# Altium schematic sheet AMU_type_2_v1.SchDoc
size A3; Engineer: Anthony Kellam; : QUTMS Motor Control version 0.1; PageSetup: Record=PageOptions|CenterHorizontal=True|CenterVertical=True|PrintScale=1.00|XCorrection=1.00|YCorrection=1.00|PrintKind=0|BorderSize=5000000|LeftOffset=0|BottomOffset=0|Orientation=2|PaperLength=1000|PaperWidth=1000|Scale=100|PaperSource=7|PrintQuality=-3|MediaType=1|DitherType=10|PrintScaleMode=0|PaperKind=A3|PaperIndex=8; DocumentName: QUTMS Motor Control rev A
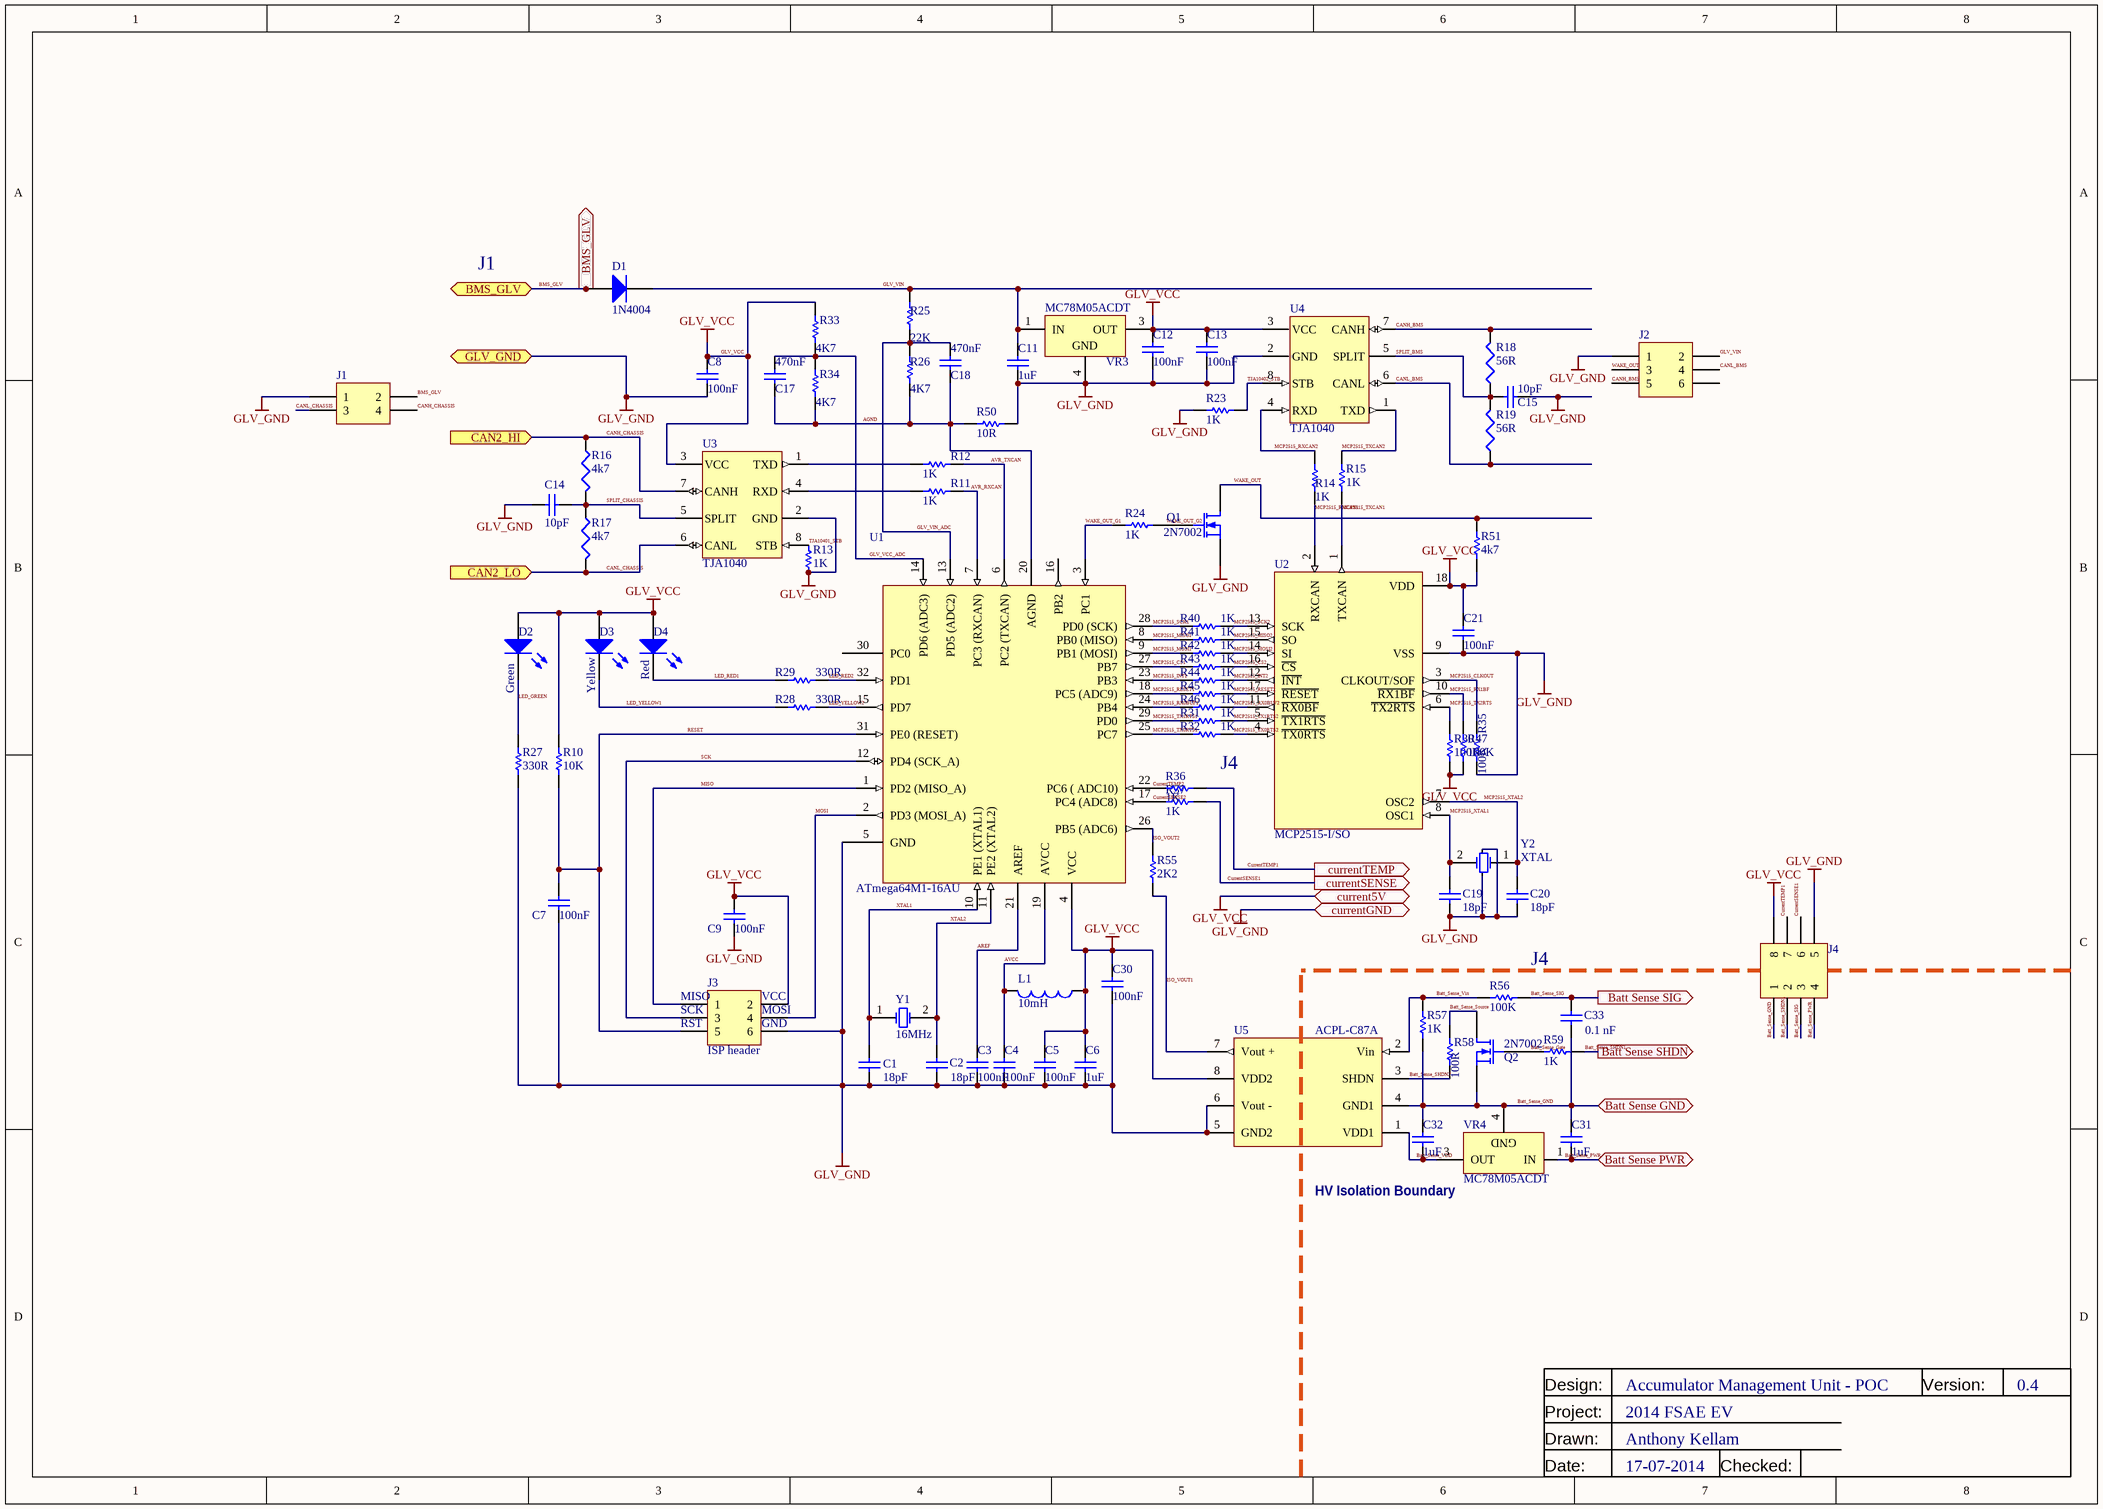
[diagram p0: AMU_type_2_v1.SchDoc]

## Parts
C1  value 18pF  [0603C]  (hidden comment: Cap Semi)
C2  value 18pF  [0603C]  (hidden comment: Cap Semi)
C3  value 100nF  [0603C]  (hidden comment: Cap Semi)
C4  value 100nF  [0603C]  (hidden comment: Cap Semi)
C5  value 100nF  [0603C]  (hidden comment: Cap Semi)
C6  value 1uF  [0603C]  (hidden comment: Cap Semi)
C7  value 100nF  [0603C]  (hidden comment: Cap Semi)
C8  value 100nF  [0603C]  (hidden comment: Cap Semi)
C9  value 100nF  [0603C]  (hidden comment: Cap Semi)
C11  value 1uF  [0603C]  (hidden comment: Cap Semi)
C12  value 100nF  [0603C]  (hidden comment: Cap Semi)
C13  value 100nF  [0603C]  (hidden comment: Cap Semi)
C14  value 10pF  [0603C]  (hidden comment: Cap Semi)
C15  value 10pF  [0603C]  (hidden comment: Cap Semi)
C17  value 470nF  [0603C]  (hidden comment: Cap Semi)
C18  value 470nF  [0603C]  (hidden comment: Cap Semi)
C19  value 18pF  [0603C]  (hidden comment: Cap Semi)
C20  value 18pF  [0603C]  (hidden comment: Cap Semi)
C21  value 100nF  [0603C]  (hidden comment: Cap Semi)
C30  value 100nF  [0603C]  (hidden comment: Cap Semi)
C31  value 1uF  [0603C]  (hidden comment: Cap Semi)
C32  value 1uF  [0603C]  (hidden comment: Cap Semi)
C33  value 0.1 nF  [0603C]  (hidden comment: Cap Semi)
D1  1N4004  [DO-214AC]
D2  Green  [2012[0805]_LED]
D3  Yellow  [2012[0805]_LED]
D4  Red  [2012[0805]_LED]
J1  Header 2X2  [Molex 4 Pin]  (value not drawn)
J2  Header 3X2  [Molex 6 Pin]  (value not drawn)
J3  ISP header  [ISP Header]
J4  Header 4X2  [MOLEX_8]  (value not drawn)
L1  value 10mH  [2012[0805]_IND]  (hidden comment: Inductor)
Q1  2N7002  [SOT23A]
Q2  2N7002  [SOT23A]
R10  value 10K  [2012[0805]_Res]  (hidden comment: Res1)
R11  value 1K  [2012[0805]_Res]  (hidden comment: Res1)
R12  value 1K  [2012[0805]_Res]  (hidden comment: Res1)
R13  value 1K  [2012[0805]_Res]  (hidden comment: Res1)
R14  value 1K  [2012[0805]_Res]  (hidden comment: Res1)
R15  value 1K  [2012[0805]_Res]  (hidden comment: Res1)
R16  value 4k7  [2012[0805]_Res]  (hidden comment: Res3)
R17  value 4k7  [2012[0805]_Res]  (hidden comment: Res3)
R18  value 56R  [2012[0805]_Res]  (hidden comment: Res3)
R19  value 56R  [2012[0805]_Res]  (hidden comment: Res3)
R23  value 1K  [2012[0805]_Res]  (hidden comment: Res1)
R24  value 1K  [2012[0805]_Res]  (hidden comment: Res1)
R25  value 22K  [2012[0805]_Res]  (hidden comment: Res1)
R26  value 4K7  [2012[0805]_Res]  (hidden comment: Res1)
R27  value 330R  [2012[0805]_Res]  (hidden comment: Res1)
R28  value 330R  [2012[0805]_Res]  (hidden comment: Res1)
R29  value 330R  [2012[0805]_Res]  (hidden comment: Res1)
R30  value 100K  [2012[0805]_Res]  (hidden comment: Res1)
R31  value 1K  [2012[0805]_Res]  (hidden comment: Res1)
R32  value 1K  [2012[0805]_Res]  (hidden comment: Res1)
R33  value 4K7  [2012[0805]_Res]  (hidden comment: Res1)
R34  value 4K7  [2012[0805]_Res]  (hidden comment: Res1)
R35  value 100K  [2012[0805]_Res]  (hidden comment: Res1)
R36  value 1K  [2012[0805]_Res]  (hidden comment: Res1)
R37  value 1K  [2012[0805]_Res]  (hidden comment: Res1)
R40  value 1K  [2012[0805]_Res]  (hidden comment: Res1)
R41  value 1K  [2012[0805]_Res]  (hidden comment: Res1)
R42  value 1K  [2012[0805]_Res]  (hidden comment: Res1)
R43  value 1K  [2012[0805]_Res]  (hidden comment: Res1)
R44  value 1K  [2012[0805]_Res]  (hidden comment: Res1)
R45  value 1K  [2012[0805]_Res]  (hidden comment: Res1)
R46  value 1K  [2012[0805]_Res]  (hidden comment: Res1)
R47  value 100K  [2012[0805]_Res]  (hidden comment: Res1)
R50  value 10R  [2012[0805]_Res]  (hidden comment: Res1)
R51  value 4k7  [2012[0805]_Res]  (hidden comment: Res1)
R55  value 2K2  [2012[0805]_Res]  (hidden comment: Res1)
R56  value 100K  [2012[0805]_Res]  (hidden comment: Res1)
R57  value 1K  [2012[0805]_Res]  (hidden comment: Res1)
R58  value 100R  [2012[0805]_Res]  (hidden comment: Res1)
R59  value 1K  [2012[0805]_Res]  (hidden comment: Res1)
U1  ATmega64M1-16AU  [32A_L]
U2  MCP2515-I/SO  [SOIC-SO18_N]
U3  TJA1040  [SO8_L]
U4  TJA1040  [SO8_L]
U5  ACPL-C87A  [8S2_L]
VR3  MC78M05ACDT  [369A-13]
VR4  MC78M05ACDT  [369A-13]
Y1  16MHz  [Crystal]
Y2  XTAL  [MCP2515_XTAL]

## Ports
Batt Sense GND, Batt Sense PWR, Batt Sense SHDN (out), Batt Sense SIG (out), BMS_GLV, CAN2_HI (in), CAN2_LO (in), current5V, currentGND, currentSENSE (out), currentTEMP (out), GLV_GND

## Nets
GLV_GND: C1.1 C2.1 C3.2 C4.2 C5.2 C6.2 C7.1 C8.1 C9.1 C11.1 C12.1 C13.1 C14.1 C15.1 C19.2 C20.1 C21.1 C30.2 J1.1 J2.1 J3.6 J4.5 Q1.2(S) R13.1 R23.1 R27.1 R35.2 R50.2 U1.5(GND) U2.9(VSS) U3.2(GND) U4.2(GND) U5.5(GND2) U5.6(Vout_-) VR3.4(GND) Y2.3 Y2.4 ; port GLV_GND, port currentGND
GLV_VCC: C5.1 C6.1 C8.2 C9.2 C12.2 C13.2 C21.2 C30.1 D2.1(A) D3.1(A) D4.1(A) J3.2 J4.8 L1.1 R10.2 R30.1 R33.1 R47.1 R51.1 U1.4(VCC) U2.18(VDD) U3.3(VCC) U4.3(VCC) U5.8(VDD2) VR3.3(OUT) ; port current5V
AGND: C17.1 C18.1 R26.2 R34.2 R50.1 U1.20(AGND)
AREF: C3.1 U1.21(AREF)
AVCC: C4.1 L1.2 U1.19(AVCC)
AVR_RXCAN: R11.2 U1.7(PC3_(RXCAN))
AVR_TXCAN: R12.1 U1.6(PC2_(TXCAN))
Batt_Sense_Gate: Q2.1(G) R59.2
Batt_Sense_GND: C31.2 C32.2 C33.1 J4.1 Q2.2(S) R57.1 U5.4(GND1) VR4.4(GND) ; port Batt Sense GND
Batt_Sense_PWR: C31.1 J4.4 VR4.1(IN) ; port Batt Sense PWR
Batt_Sense_SHDN1: J4.2 R59.1 ; port Batt Sense SHDN
Batt_Sense_SHDN2: R58.1 U5.3(SHDN)
Batt_Sense_SIG: C33.2 J4.3 R56.1 ; port Batt Sense SIG
Batt_Sense_Source: Q2.3(D) R58.2
Batt_Sense_VDD: C32.1 U5.1(VDD1) VR4.3(OUT)
Batt_Sense_Vin: R56.2 R57.2 U5.2(Vin)
BMS_GLV: D1.1(A) J1.2 ; port BMS_GLV
CANH_BMS: J2.5 R18.2 U4.7(CANH)
CANH_CHASSIS: J1.4 R16.1 U3.7(CANH) ; port CAN2_HI
CANL_BMS: J2.4 R19.1 U4.6(CANL)
CANL_CHASSIS: J1.3 R17.2 U3.6(CANL) ; port CAN2_LO
CurrentSENSE1: J4.6 R37.1 ; port currentSENSE
CurrentSENSE2: R37.2 U1.17(PC4_(ADC8))
CurrentTEMP1: J4.7 R36.1 ; port currentTEMP
CurrentTEMP2: R36.2 U1.22(PC6_(_ADC10))
GLV_VCC_ADC: C17.2 R33.2 R34.1 U1.14(PD6_(ADC3))
GLV_VIN: C11.2 D1.2(K) J2.2 R25.1 VR3.1(IN)
GLV_VIN_ADC: C18.2 R25.2 R26.1 U1.13(PD5_(ADC2))
ISO_VOUT1: R55.2 U5.7(Vout_+)
ISO_VOUT2: R55.1 U1.26(PB5_(ADC6))
LED_GREEN: D2.2(K) R27.2
LED_RED1: D4.2(K) R29.1
LED_RED2: R29.2 U1.32(PD1)
LED_YELLOW1: D3.2(K) R28.1
LED_YELLOW2: R28.2 U1.15(PD7)
MCP2515_CLKOUT: R35.1 U2.3(CLKOUT/SOF)
MCP2515_CS1: R43.1 U1.27(PB7)
MCP2515_CS2: R43.2 U2.16(~{CS})
MCP2515_INT1: R44.1 U1.23(PB3)
MCP2515_INT2: R44.2 U2.12(~{INT})
MCP2515_MISO1: R41.1 U1.8(PB0_(MISO))
MCP2515_MISO2: R41.2 U2.15(SO)
MCP2515_MOSI1: R42.1 U1.9(PB1_(MOSI))
MCP2515_MOSI2: R42.2 U2.14(SI)
MCP2515_RESET1: R45.1 U1.18(PC5_(ADC9))
MCP2515_RESET2: R45.2 U2.17(~{RESET})
MCP2515_RX0BUF1: R46.1 U1.24(PB4)
MCP2515_RX0BUF2: R46.2 U2.11(~{RX0BF})
MCP2515_RX1BF: R47.2 U2.10(~{RX1BF})
MCP2515_RXCAN1: R14.2 U2.2(RXCAN)
MCP2515_RXCAN2: R14.1 U4.4(RXD)
MCP2515_SCK1: R40.1 U1.28(PD0_(SCK))
MCP2515_SCK2: R40.2 U2.13(SCK)
MCP2515_TX0RTS1: R32.1 U1.25(PC7)
MCP2515_TX0RTS2: R32.2 U2.4(~{TX0RTS})
MCP2515_TX1RTS1: R31.1 U1.29(PD0)
MCP2515_TX1RTS2: R31.2 U2.5(~{TX1RTS})
MCP2515_TX2RTS: R30.2 U2.6(~{TX2RTS})
MCP2515_TXCAN1: R15.2 U2.1(TXCAN)
MCP2515_TXCAN2: R15.1 U4.1(TXD)
MCP2515_XTAL1: C19.1 U2.8(OSC1) Y2.2(OSC2)
MCP2515_XTAL2: C20.2 U2.7(OSC2) Y2.1(OSC1)
MISO: J3.1 U1.1(PD2_(MISO_A))
MOSI: J3.4 U1.2(PD3_(MOSI_A))
RESET: C7.2 J3.5 R10.1 U1.31(PE0_(RESET))
SCK: J3.3 U1.12(PD4_(SCK_A))
SPLIT_BMS: C15.2 R18.1 R19.2 U4.5(SPLIT)
SPLIT_CHASSIS: C14.2 R16.2 R17.1 U3.5(SPLIT)
TJA10401_STB: R13.2 U3.8(STB)
TJA10402_STB: R23.2 U4.8(STB)
WAKE_OUT: J2.3 Q1.3(D) R51.2
WAKE_OUT_G1: R24.1 U1.3(PC1)
WAKE_OUT_G2: Q1.1(G) R24.2
XTAL1: C1.2 U1.10(PE1_(XTAL1)) Y1.1(OSC1)
XTAL2: C2.2 U1.11(PE2_(XTAL2)) Y1.2(OSC2)
NetR11_1: R11.1 U3.4(RXD)
NetR12_2: R12.2 U3.1(TXD)

Not connected (* = marked no-connect by the designer): J2 6; U1 16(PB2) 30(PC0)

## Notes on the sheet
- J1
- J4
- (near J3) SCK
- (near J3) RST
- (near J3) MISO
- (near J3) MOSI
- (near J3) GND
- (near J3) VCC
- HV Isolation Boundary
- Design:
- Accumulator Management Unit - POC
- Version:
- 0.4
- Project:
- Drawn:
- 2014 FSAE EV
- Anthony Kellam
- Date:
- 17-07-2014
- Checked:

## Library data of the parts
C1-C9 C11-C15 C17-C21 C30-C33 = Cap Semi: Capacitor (Semiconductor SIM Model); Published: 8-Jun-2000; LatestRevisionDate: 17-Jul-2002; LatestRevisionNote: Re-released for DXP Platform.; PackageReference: C1206; Publisher: Altium Limited
D1 = Diode: Default Diode; Published: 8-Jun-2000; LatestRevisionDate: 17-Jul-2002; LatestRevisionNote: Re-released for DXP Platform.; PackageDocument: Sep-1996; PackageReference: SMC; Publisher: Altium Limited; Code_JEDEC: DO-214-AB
D2-D4 = LED2: Typical RED, GREEN, YELLOW, AMBER GaAs LED; Published: 8-Jun-2000; LatestRevisionDate: 17-Jul-2002; LatestRevisionNote: Re-released for DXP Platform.; PackageDocument: Feb-2002; PackageReference: 3.2X1.6X1.1; Publisher: Altium Limited
J1 = Header 2X2: Header, 2-Pin, Dual row; LatestRevisionDate: 17-Jul-2002; LatestRevisionNote: Re-released for DXP Platform.; Publisher: Altium Limited
J2 J3 = Header 3X2: Header, 3-Pin, Dual row; LatestRevisionDate: 17-Jul-2002; LatestRevisionNote: Re-released for DXP Platform.; Publisher: Altium Limited
J4 = Header 4X2: Header, 4-Pin, Dual row; LatestRevisionDate: 17-Jul-2002; LatestRevisionNote: Re-released for DXP Platform.; Publisher: Altium Limited
L1 = Inductor: Code_IEC: 1005; Published: 8-Jun-2000; LatestRevisionDate: 17-Jul-2002; LatestRevisionNote: Re-released for DXP Platform.; PackageReference: 0402-A; Publisher: Altium Limited; Code_JEITA: 0402
Q1 = MOSFET-N: N-Channel MOSFET; Manufacturer: NXP Semiconductors; Manufacturer Part Number: 2N7002P,215; PackageDocument: 1995/1996; FET Type: MOSFET N-Channel, Metal Oxide; FET Feature: Logic Level Gate; Drain to Source Voltage (Vdss): 60V; Current - Continuous Drain (Id) @ 25°C: 360mA (Ta); Rds On (Max) @ Id, Vgs: 1.6 Ohm @ 500mA, 10V; Vgs(th) (Max) @ Id: 2.4V @ 250µA; Gate Charge (Qg) @ Vgs: 0.8nC @ 4.5V; Input Capacitance (Ciss) @ Vds: 50pF @ 10V; Power - Max: 350mW; Published: 8-Jun-2000; LatestRevisionDate: 17-Jul-2002; LatestRevisionNote: Re-released for DXP Platform.; PackageReference: E3; Publisher: Altium Limited; Supplier 1: Digi-Key; RoHS: RoHS Compliant; Category: Discrete Semiconductor Products; Stock 1: 319890; Pricing 1: 1=0.19, 10=0.177, 100=0.0968, 500=0.05954, 1000=0.04061 (AUD); Packaging: Cut Tape (CT); Operating Temperature: -55°C ~ 150°C (TJ); Mounting Type: Surface Mount; Package / Case: TO-236-3, SC-59, SOT-23-3; Supplier Device Package: SOT-23 (TO-236AB); ComponentLink1URL: http://www.nxp.com/documents/data_sheet/2N7002P.pdf; ComponentLink1Description: http://www.nxp.com/documents/data_sheet/2N7002P.pdf
Q2 = MOSFET-N: N-Channel MOSFET; PackageDocument: 1995/1996; Published: 8-Jun-2000; LatestRevisionDate: 17-Jul-2002; LatestRevisionNote: Re-released for DXP Platform.; PackageReference: E3; Publisher: Altium Limited
R10-R15 R23-R37 R40-R47 R50 R51 R55-R59 = Res1: Resistor; Published: 8-Jun-2000; LatestRevisionDate: 17-Jul-2002; LatestRevisionNote: Re-released for DXP Platform.; PackageReference: AXIAL-0.3; Publisher: Altium Limited
R16-R19 = Res3: Resistor; Published: 8-Jun-2000; LatestRevisionDate: 04-Mar-2005; LatestRevisionNote: PCB Footprint replaced.; PackageReference: J1-0603; Publisher: Altium Limited
U1 = ATmega8-16AC: 8-Bit AVR Microcontroller with 8K Bytes of In-System Programmable Flash Memory; Published: 17-Sep-2003; LatestRevisionDate: 13-Apr-2006; LatestRevisionNote: IPC-7351 Footprint Added.; DatasheetVersion: 2486H-AVR-09/02; PackageVersion: revB, Oct-2001; PackageReference: 32A; Publisher: Altium Limited; PackageDescription: 32-Pin Thin Quad Flat Pack 0.8 mm Pitch; Code_JEDEC: MS-026-ABA; ComponentLink1Description: Manufacturer Link; ComponentLink1URL: http://www.atmel.com; ComponentLink2Description: Datasheet; ComponentLink2URL: http://www.atmel.com/dyn/resources/prod_documents/doc2486.pdf
U2 = MCP2515-I/SO: Stand-Alone CAN Controller With SPI Interface, 18-Pin SOIC, Industrial Temperature; Published: 29-Jan-2009; DatasheetVersion: revE, Nov-2007; PackageVersion: revBB, Aug-2009; PackageReference: SOIC-SO18; Publisher: Altium Limited; PackageDescription: 18-Lead Plastic Small Outline (SO) - Wide 7.50mm Body [SOIC]; Supplier 1: Digi-Key; Supplier Part Number 1: MCP2515-I/SO-ND; Supplier 2: Farnell; Supplier Part Number 2: 1292239; Code_JEDEC: MS-013; ComponentLink1Description: Datasheet; ComponentLink1URL: http://ww1.microchip.com/downloads/en/DeviceDoc/21801e.pdf; ComponentLink2Description: Packaging Specification; ComponentLink2URL: http://www.microchip.com/stellent/groups/techpub_sg/documents/packagingspec/en012702.pdf; ComponentLink3Description: Microchip.com Home; ComponentLink3URL: http://www.microchip.com/
U5 = AT90S2343-10SI: Isolated CAN transceiver; Published: 17-Sep-2003; LatestRevisionDate: 13-Apr-2006; LatestRevisionNote: IPC-7351 Footprint Added.; DatasheetVersion: 1004D-09/01; PackageVersion: revB, May-2002; PackageReference: 8S2; Publisher: Altium Limited; PackageDescription: 8-Pin Small Outline Package 1.27 mm Pitch; ComponentLink1Description: Manufacturer Link; ComponentLink1URL: http://www.atmel.com; ComponentLink2Description: Datasheet; ComponentLink2URL: http://www.atmel.com/dyn/resources/prod_documents/doc1004.pdf
VR3 VR4 = MC78M05ACDT: Three-Terminal Medium Current Positive Voltage Regulator; Note: Pin 2 is electrically connected to Pin 4; Pin 2 is trimmed and not drawn;; Published: 15-Apr-2002; DatasheetVersion: Apr-2000; PackageVersion: 1997; PackageReference: 369A-13; Publisher: Altium Limited; PackageDescription: D-PAK/TO-252-AA; 3 Leads (1 Cropped); Body 10.3 (inc. leads) x 6.7 mm (LxW max); ComponentLink1Description: Manufacturer Link; ComponentLink1URL: http://www.onsemi.com/site/products/taxonomy/0,4438,503,00.html; ComponentLink2Description: Datasheet; ComponentLink2URL: http://www.onsemi.com/pub/Collateral/MC78M00-D.PDF
Y1 Y2 = XTAL: Crystal Oscillator; Published: 8-Jun-2000; LatestRevisionDate: 17-Jul-2002; LatestRevisionNote: Re-released for DXP Platform.; PackageReference: R38; Publisher: Altium Limited
  Y2: PackageDescription: Crystal, Thru-Hole; 2 Leads; Body 3.1 x 8.2 mm (Dia.xH)